# EAGLE schematic GatewaySTM321.0 (EAGLE 5.10)

## Sheet 1 of 3
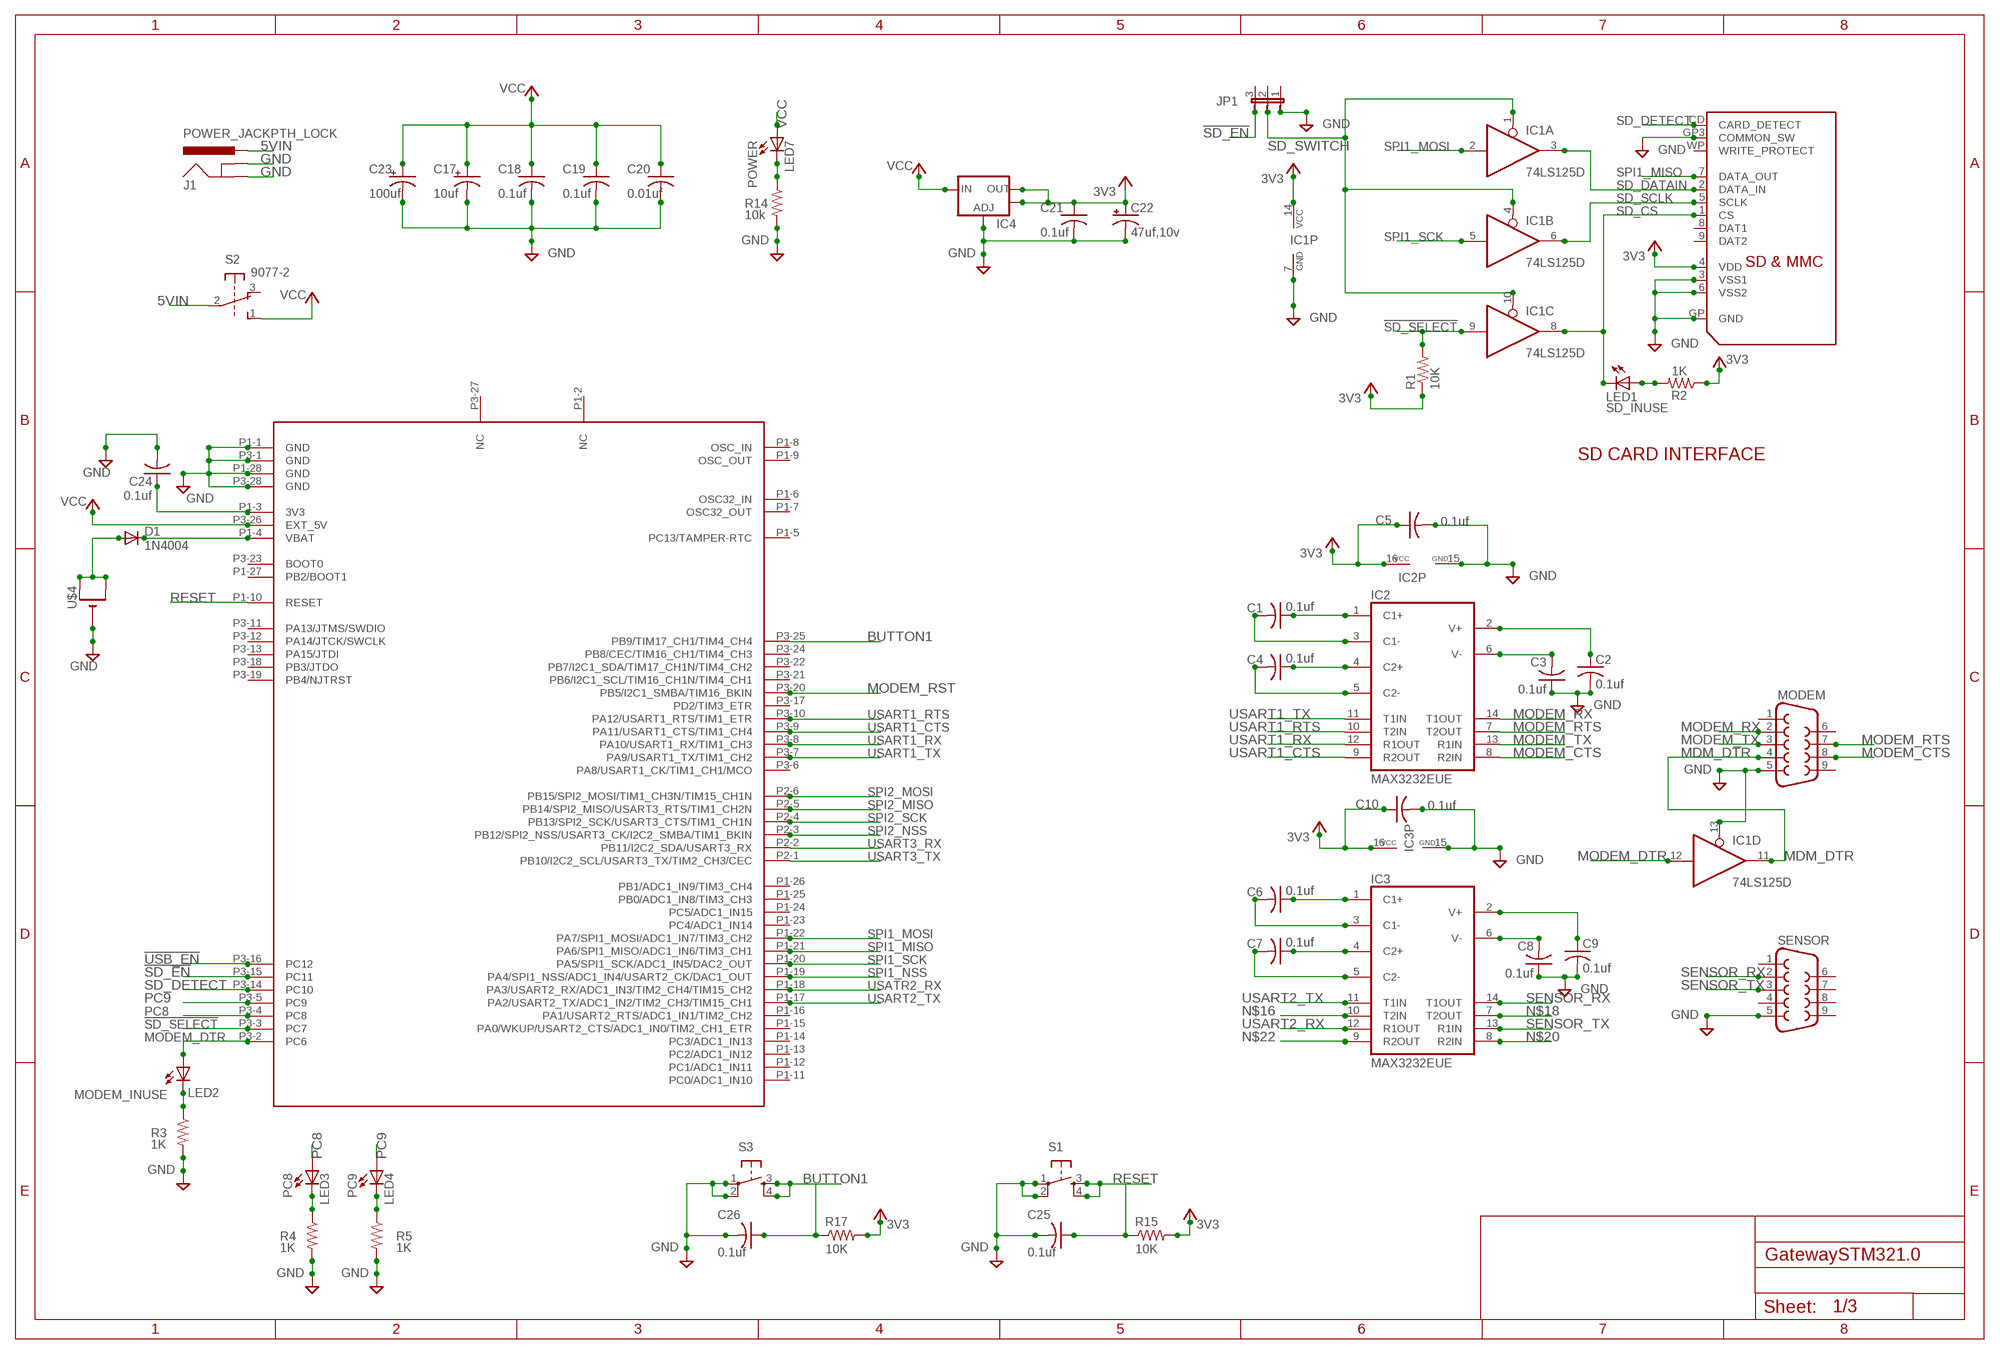
[diagram p0: schematic, sheet 1]

### Parts
C1  0.1uf  C-USC0805K  [C0805K]
C2  0.1uf  C-USC0805K  [C0805K]
C3  0.1uf  C-USC0805K  [C0805K]
C4  0.1uf  C-USC0805K  [C0805K]
C5  0.1uf  C-USC1206  [C1206]
C6  0.1uf  C-USC0805K  [C0805K]
C7  0.1uf  C-USC0805K  [C0805K]
C8  0.1uf  C-USC0805K  [C0805K]
C9  0.1uf  C-USC0805K  [C0805K]
C10  0.1uf  C-USC1206  [C1206]
C17  10uf  CPOL-USSMCC  [SMC_C]
C18  0.1uf  C-USC0805K  [C0805K]
C19  0.1uf  C-USC0805K  [C0805K]
C20  0.01uf  C-USC0805K  [C0805K]
C21  0.1uf  C-USC0805K  [C0805K]
C22  47uf,10v  CPOL-USE2.5-7  [E2,5-7]
C23  100uf  CPOL-USSMCE  [SMC_E]
C24  0.1uf  C-USC0805K  [C0805K]
C25  0.1uf  C-USC0805K  [C0805K]
C26  0.1uf  C-USC0805K  [C0805K]
D1  1N4004  1N4148DO35-7  [DO35-7]
IC1  74LS125D  [SO14]
IC2  MAX3232EUE  [TSSOP16]
IC3  MAX3232EUE  [TSSOP16]
IC4  V_REG_LM1117SOT223  [SOT223]
J1  POWER_JACKPTH_LOCK  [POWER_JACK_PTH_LOCK]
JP1  JP2E  [JP2]
LED1  SD_INUSE  LEDCHIPLED_0805  [CHIPLED_0805]
LED2  MODEM_INUSE  LEDCHIPLED_0805  [CHIPLED_0805]
LED3  PC8  LEDCHIPLED_0805  [CHIPLED_0805]
LED4  PC9  LEDCHIPLED_0805  [CHIPLED_0805]
LED7  POWER  LEDCHIPLED_0805  [CHIPLED_0805]
MODEM  DB9  [DB9]
R1  10K  R-US_R0805  [R0805]
R2  1K  R-US_R0805  [R0805]
R3  1K  R-US_R0805  [R0805]
R4  1K  R-US_R0805  [R0805]
R5  1K  R-US_R0805  [R0805]
R14  10k  R-US_R0805  [R0805]
R15  10K  R-US_R0805  [R0805]
R17  10K  R-US_R0805  [R0805]
S1  TAC_SWITCHPTH  [TACTILE-PTH]
S2  9077-2  [9077-2]
S3  TAC_SWITCHPTH  [TACTILE-PTH]
SENSOR  DB9  [DB9]
U$1  STM32VLDSCVR  [STM32VLDISCVR]
U$2  SDMMC06132  [06132]
U$4  CR1220THM  [CR1220-THM]

### Nets
3V3: C5.1 C10.1 C21.1 C22.+ IC1.14(P:VCC) IC2.16(VCC) IC3.16(VCC) IC4.2(OUT) IC4.4(OUT) R1.1 R2.1 U$2.4(VDD) ; also sheet 2,3
5VIN: J1.PWR S2.2(1:P)
!SD_EN: U$1.P3-15(PC11)
!SD_SELECT: IC1.9(C:I) R1.2 U$1.P3-3(PC7)
!USB_EN: U$1.P3-16(PC12) ; also sheet 2
BUTTON1: C26.1 R17.1 S3.3 S3.4 U$1.P3-25(PB9/TIM17_CH1/TIM4_CH4)
GND: C2.2 C3.1 C5.2 C8.1 C9.2 C10.2 C17.- C18.2 C19.2 C20.2 C21.2 C22.- C23.- C24.2 C25.2 C26.2 IC1.7(P:GND) IC1.13(D:OE) IC2.15(GND) IC3.15(GND) IC4.1(ADJ) J1.GND J1.GNDBREAK MODEM.5 R3.2 R4.2 R5.2 R14.2 S1.1 S1.2 S3.1 S3.2 SENSOR.5 U$1.P1-1(GND) U$1.P1-28(GND) U$1.P3-1(GND) U$1.P3-28(GND) U$2.3(VSS1) U$2.6(VSS2) U$2.GP3(COMMON_SW) U$2.GP(GND) U$4.- ; also sheet 2,3
MDM_DTR: IC1.11(D:O) MODEM.4 ; also sheet 3
MODEM_CTS: IC2.8(R2IN) MODEM.8
MODEM_DTR: IC1.12(D:I) LED2.A U$1.P3-2(PC6)
MODEM_RST: U$1.P3-20(PB5/I2C1_SMBA/TIM16_BKIN) ; also sheet 3
MODEM_RTS: IC2.7(T2OUT) MODEM.7
MODEM_RX: IC2.14(T1OUT) MODEM.2
MODEM_TX: IC2.13(R1IN) MODEM.3
N$1: C6.1 IC3.1(C1+)
N$2: C1.1 IC2.1(C1+)
N$3: C1.2 IC2.3(C1-)
N$4: LED1.A R2.2
N$5: LED2.C R3.1
N$6: C4.1 IC2.4(C2+)
N$7: C4.2 IC2.5(C2-)
N$8: C3.2 IC2.6(V-)
N$9: C2.1 IC2.2(V+)
N$10: C6.2 IC3.3(C1-)
N$11: C7.1 IC3.4(C2+)
N$12: C7.2 IC3.5(C2-)
N$13: C8.2 IC3.6(V-)
N$14: LED3.C R4.1
N$15: C9.1 IC3.2(V+)
N$16: IC3.10(T2IN)
N$17: LED4.C R5.1
N$18: IC3.7(T2OUT)
N$20: IC3.8(R2IN)
N$22: IC3.9(R2OUT)
N$25: LED7.C R14.1
N$32: D1.A U$4.+1(+) U$4.+2(+1)
N$36: C24.1 U$1.P1-3(3V3)
N$40: D1.C U$1.P1-4(VBAT)
PC8: LED3.A U$1.P3-4(PC8)
PC9: LED4.A U$1.P3-5(PC9)
RESET: C25.1 R15.1 S1.3 S1.4 U$1.P1-10(RESET) ; also sheet 3
SD_CS: IC1.8(C:O) LED1.C U$2.1(CS)
SD_DATAIN: IC1.3(A:O) U$2.2(DATA_IN)
SD_DETECT: U$1.P3-14(PC10) U$2.CD(CARD_DETECT)
SD_SCLK: IC1.6(B:O) U$2.5(SCLK)
SD_SWITCH: IC1.1(A:OE) IC1.4(B:OE) IC1.10(C:OE)
SENSOR_RX: IC3.14(T1OUT) SENSOR.2
SENSOR_TX: IC3.13(R1IN) SENSOR.3
SPI1_MISO: U$1.P1-21(PA6/SPI1_MISO/ADC1_IN6/TIM3_CH1) U$2.7(DATA_OUT)
SPI1_MOSI: IC1.2(A:I) U$1.P1-22(PA7/SPI1_MOSI/ADC1_IN7/TIM3_CH2)
SPI1_NSS: U$1.P1-19(PA4/SPI1_NSS/ADC1_IN4/USART2_CK/DAC1_OUT)
SPI1_SCK: IC1.5(B:I) U$1.P1-20(PA5/SPI1_SCK/ADC1_IN5/DAC2_OUT)
SPI2_MISO: U$1.P2-5(PB14/SPI2_MISO/USART3_RTS/TIM1_CH2N) ; also sheet 3
SPI2_MOSI: U$1.P2-6(PB15/SPI2_MOSI/TIM1_CH3N/TIM15_CH1N) ; also sheet 3
SPI2_NSS: U$1.P2-3(PB12/SPI2_NSS/USART3_CK/I2C2_SMBA/TIM1_BKIN) ; also sheet 3
SPI2_SCK: U$1.P2-4(PB13/SPI2_SCK/USART3_CTS/TIM1_CH1N)
USART1_CTS: IC2.9(R2OUT) U$1.P3-9(PA11/USART1_CTS/TIM1_CH4) ; also sheet 3
USART1_RTS: IC2.10(T2IN) U$1.P3-10(PA12/USART1_RTS/TIM1_ETR) ; also sheet 3
USART1_RX: IC2.12(R1OUT) U$1.P3-8(PA10/USART1_RX/TIM1_CH3) ; also sheet 3
USART1_TX: IC2.11(T1IN) U$1.P3-7(PA9/USART1_TX/TIM1_CH2) ; also sheet 3
USART2_RX: IC3.12(R1OUT) ; also sheet 3
USART2_TX: IC3.11(T1IN) U$1.P1-17(PA2/USART2_TX/ADC1_IN2/TIM2_CH3/TIM15_CH1) ; also sheet 3
USART3_RX: U$1.P2-2(PB11/I2C2_SDA/USART3_RX) ; also sheet 2,3
USART3_TX: U$1.P2-1(PB10/I2C2_SCL/USART3_TX/TIM2_CH3/CEC) ; also sheet 2,3
USATR2_RX: U$1.P1-18(PA3/USART2_RX/ADC1_IN3/TIM2_CH4/TIM15_CH2)
V+: R15.2 R17.2 ; supply symbol labelled 3V3
VCC: C17.+ C18.1 C19.1 C20.1 C23.+ IC4.3(IN) LED7.A S2.1(1:S) U$1.P3-26(EXT_5V) ; also sheet 2,3
Unconnected: JP1.1 JP1.2 JP1.3 MODEM.1 MODEM.6 MODEM.9 S2.3(1:O) S2.4(2:S) S2.5(2:P) S2.6(2:O) SENSOR.1 SENSOR.4 SENSOR.6 SENSOR.7 SENSOR.8 SENSOR.9 U$1.P1-2(NC) U$1.P1-5(PC13/TAMPER-RTC) U$1.P1-6(OSC32_IN) U$1.P1-7(OSC32_OUT) U$1.P1-8(OSC_IN) U$1.P1-9(OSC_OUT) U$1.P1-11(PC0/ADC1_IN10) U$1.P1-12(PC1/ADC1_IN11) U$1.P1-13(PC2/ADC1_IN12) U$1.P1-14(PC3/ADC1_IN13) U$1.P1-15(PA0/WKUP/USART2_CTS/ADC1_IN0/TIM2_CH1_ETR) U$1.P1-16(PA1/USART2_RTS/ADC1_IN1/TIM2_CH2) U$1.P1-23(PC4/ADC1_IN14) U$1.P1-24(PC5/ADC1_IN15) U$1.P1-25(PB0/ADC1_IN8/TIM3_CH3) U$1.P1-26(PB1/ADC1_IN9/TIM3_CH4) U$1.P1-27(PB2/BOOT1) U$1.P3-6(PA8/USART1_CK/TIM1_CH1/MCO) U$1.P3-11(PA13/JTMS/SWDIO) U$1.P3-12(PA14/JTCK/SWCLK) U$1.P3-13(PA15/JTDI) U$1.P3-17(PD2/TIM3_ETR) U$1.P3-18(PB3/JTDO) U$1.P3-19(PB4/NJTRST) U$1.P3-21(PB6/I2C1_SCL/TIM16_CH1N/TIM4_CH1) U$1.P3-22(PB7/I2C1_SDA/TIM17_CH1N/TIM4_CH2) U$1.P3-23(BOOT0) U$1.P3-24(PB8/CEC/TIM16_CH1/TIM4_CH3) U$1.P3-27(NC) U$2.8(DAT1) U$2.9(DAT2) U$2.WP(WRITE_PROTECT)

### Notes on the sheet
- SD CARD INTERFACE

## Sheet 2 of 3
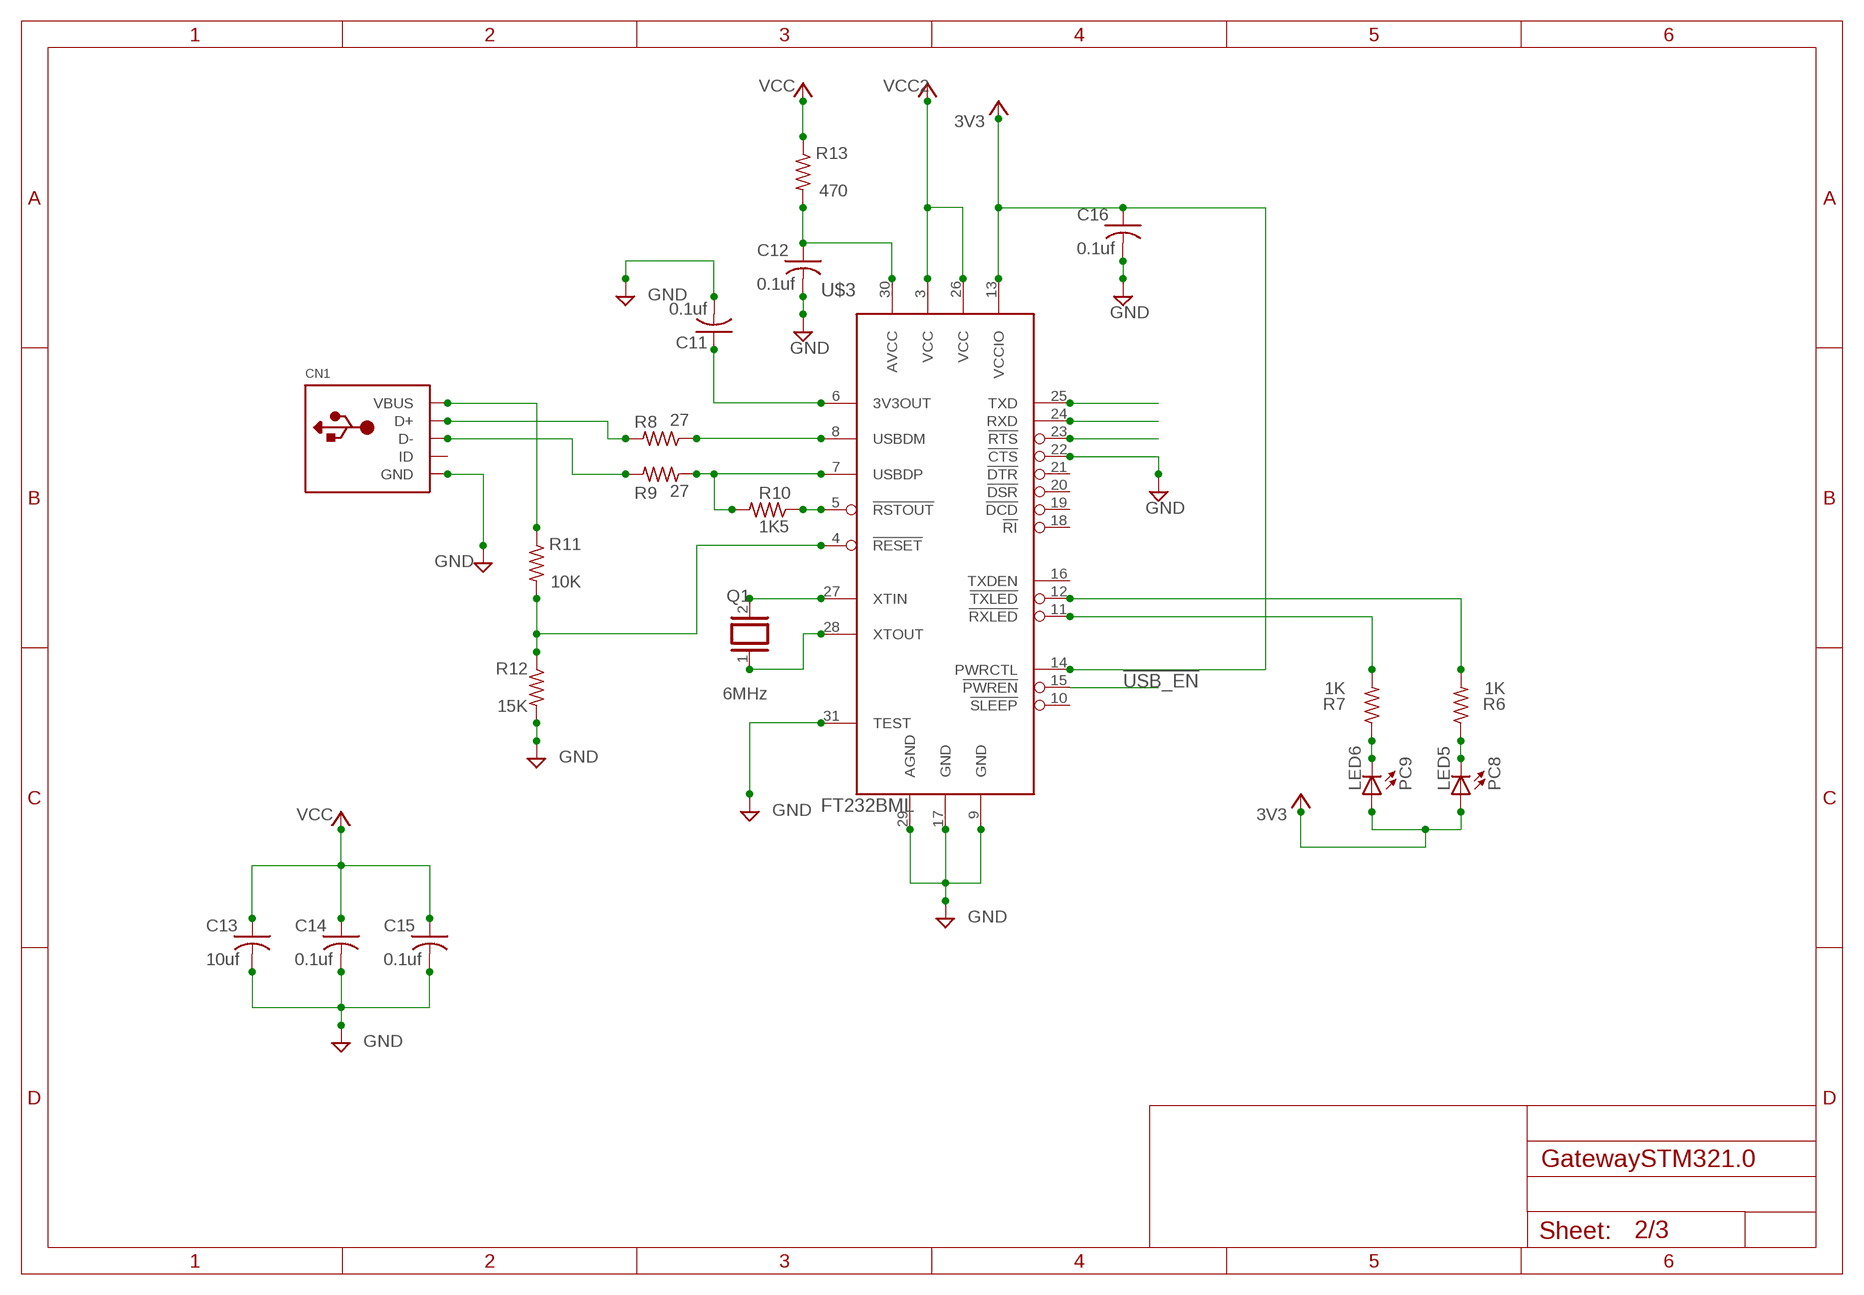
[diagram p1: schematic, sheet 2]

### Parts
C11  0.1uf  C-USC0805K  [C0805K]
C12  0.1uf  C-USC0805K  [C0805K]
C13  10uf  C-USC0805K  [C0805K]
C14  0.1uf  C-USC0805K  [C0805K]
C15  0.1uf  C-USC0805K  [C0805K]
C16  0.1uf  C-USC0805K  [C0805K]
CN1  USBMINIB  [USB-MINIB]
LED5  PC8  LEDCHIPLED_0805  [CHIPLED_0805]
LED6  PC9  LEDCHIPLED_0805  [CHIPLED_0805]
Q1  6MHz  XTAL/S  [QS]
R6  1K  R-US_R0805  [R0805]
R7  1K  R-US_R0805  [R0805]
R8  27  R-US_R0805  [R0805]
R9  27  R-US_R0805  [R0805]
R10  1K5  R-US_R0805  [R0805]
R11  10K  R-US_R0805  [R0805]
R12  15K  R-US_R0805  [R0805]
R13  470  R-US_R0805  [R0805]
U$3  FT232BML  [LQFP32]

### Nets
3V3: C16.1 LED5.A LED6.A U$3.13(VCCIO) U$3.14(PWRCTL) ; also sheet 1,3
!USB_EN: U$3.15(!PWREN) ; also sheet 1
GND: C11.2 C12.2 C13.2 C14.2 C15.2 C16.2 CN1.GND R12.2 U$3.9(GND) U$3.17(GND) U$3.22(!CTS) U$3.29(AGND) U$3.31(TEST) ; also sheet 1,3
N$19: R8.1 U$3.8(USBDM)
N$21: R9.1 R10.2 U$3.7(USBDP)
N$23: Q1.2 U$3.27(XTIN)
N$24: Q1.1 U$3.28(XTOUT)
N$26: R6.2 U$3.12(!TXLED)
N$27: R7.2 U$3.11(!RXLED)
N$28: LED5.C R6.1
N$29: LED6.C R7.1
N$30: CN1.D+ R8.2
N$31: CN1.D- R9.2
N$33: R10.1 U$3.5(!RSTOUT)
N$34: CN1.VBUS R11.1
N$35: C12.1 R13.2 U$3.30(AVCC)
N$37: R11.2 R12.1 U$3.4(!RESET)
N$38: C11.1 U$3.6(3V3OUT)
N$39: U$3.23(!RTS)
USART3_RX: U$3.25(TXD) ; also sheet 1,3
USART3_TX: U$3.24(RXD) ; also sheet 1,3
VCC: C13.1 C14.1 C15.1 R13.1 U$3.3(VCC) U$3.26(VCC) ; supply symbol labelled VCC2 ; also sheet 1,3
Unconnected: CN1.ID U$3.10(!SLEEP) U$3.16(TXDEN) U$3.18(!RI) U$3.19(!DCD) U$3.20(!DSR) U$3.21(!DTR)

## Sheet 3 of 3
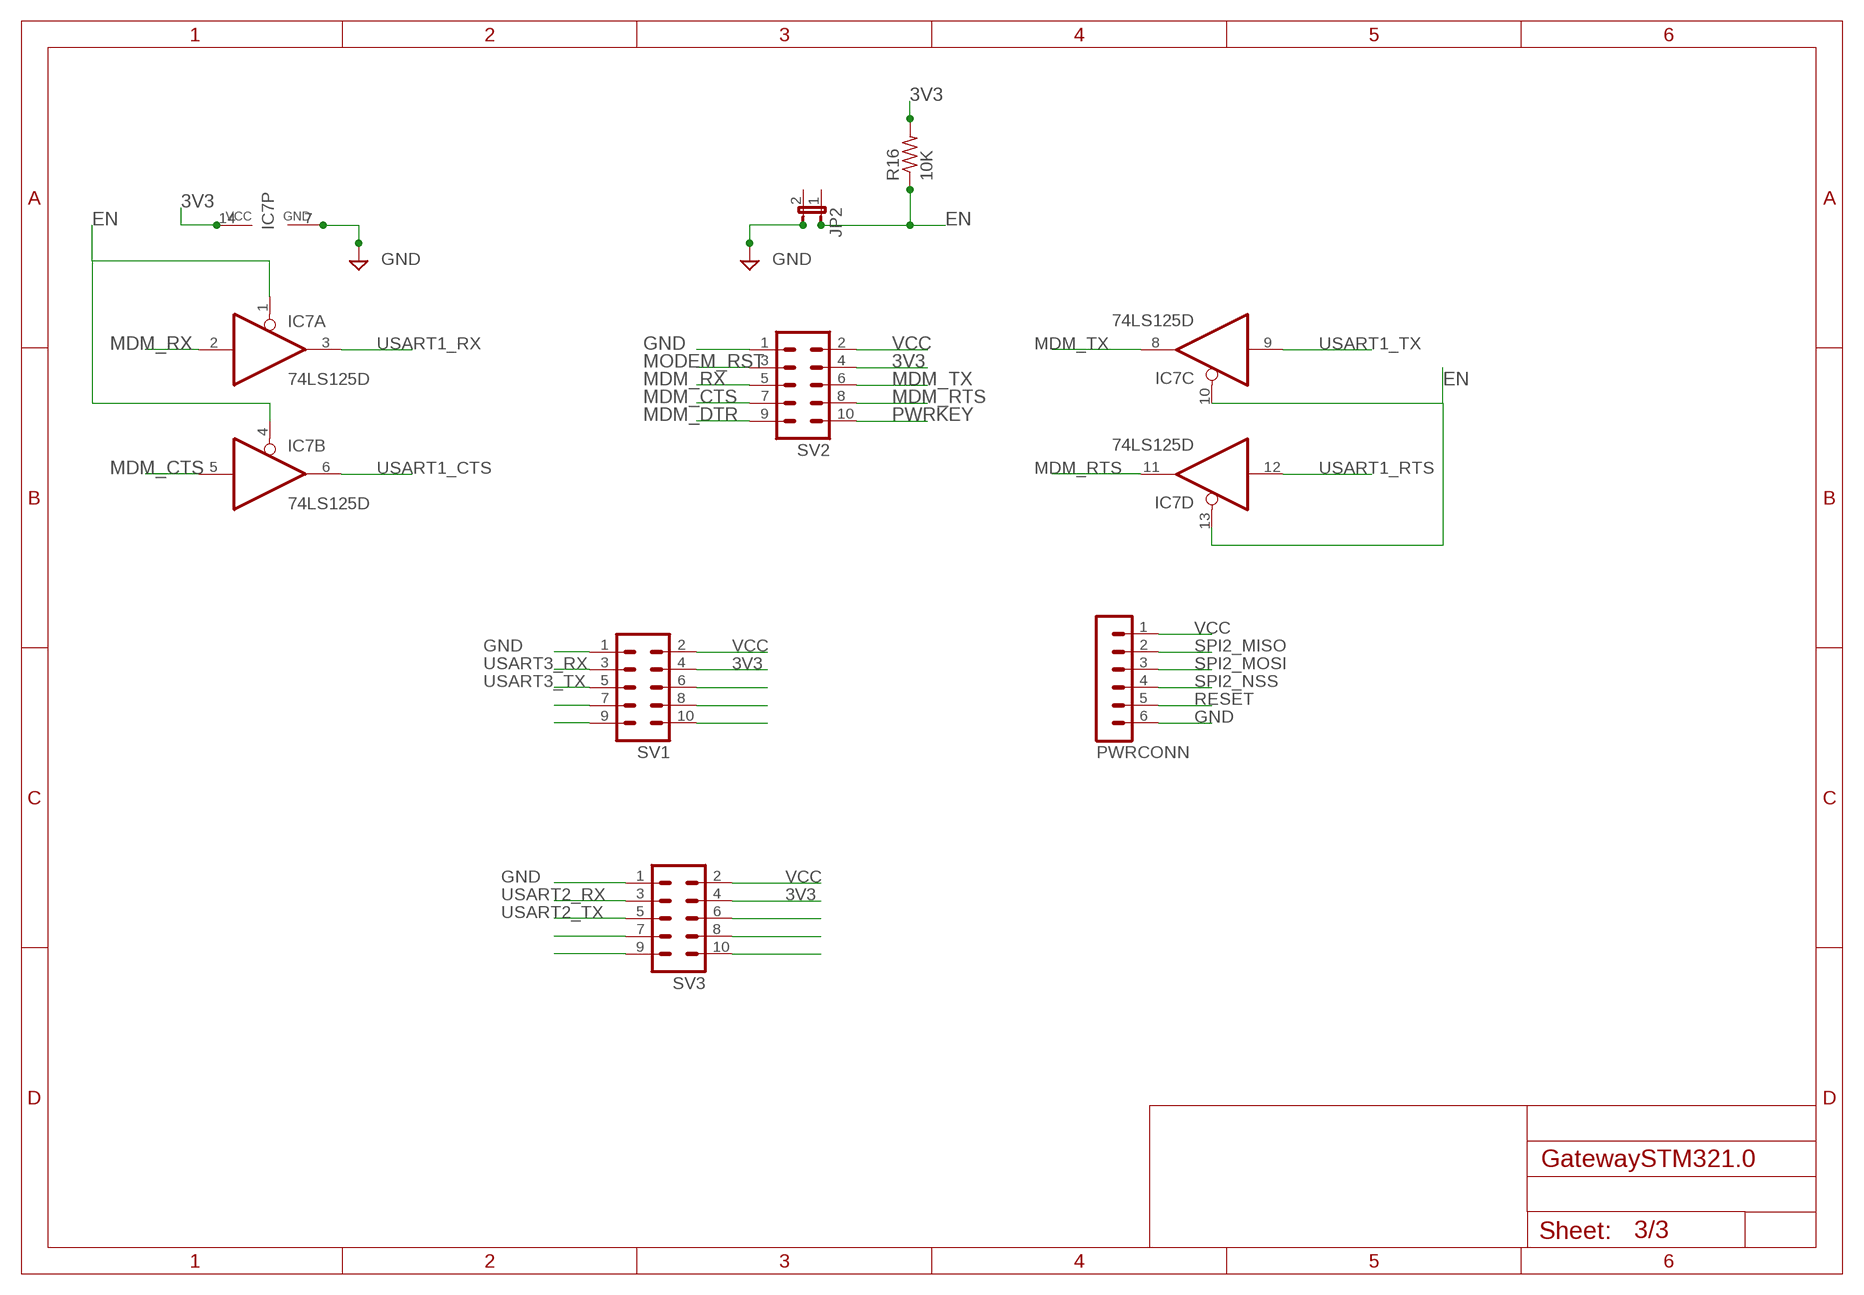
[diagram p2: schematic, sheet 3]

### Parts
IC7  74LS125D  [SO14]
JP2  JP1E  [JP1]
PWRCONN  MA06-1  [MA06-1]
R16  10K  R-US_R0805  [R0805]
SV1  MA05-2  [MA05-2]
SV2  MA05-2  [MA05-2]
SV3  MA05-2  [MA05-2]

### Nets
3V3: IC7.14(P:VCC) R16.2 SV1.4 SV2.4 SV3.4 ; also sheet 1,2
EN: IC7.1(A:OE) IC7.4(B:OE) IC7.10(C:OE) IC7.13(D:OE) R16.1
GND: IC7.7(P:GND) PWRCONN.6 SV1.1 SV2.1 SV3.1 ; also sheet 1,2
MDM_CTS: IC7.5(B:I) SV2.7
MDM_DTR: SV2.9 ; also sheet 1
MDM_RTS: IC7.11(D:O) SV2.8
MDM_RX: IC7.2(A:I) SV2.5
MDM_TX: IC7.8(C:O) SV2.6
MODEM_RST: SV2.3 ; also sheet 1
N$46: SV1.6
N$51: SV1.8
N$52: SV1.7
N$53: SV1.9
N$54: SV1.10
N$58: SV3.7
N$59: SV3.9
N$62: SV3.6
N$63: SV3.8
N$64: SV3.10
PWRKEY: SV2.10
RESET: PWRCONN.5 ; also sheet 1
SPI2_MISO: PWRCONN.2 ; also sheet 1
SPI2_MOSI: PWRCONN.3 ; also sheet 1
SPI2_NSS: PWRCONN.4 ; also sheet 1
USART1_CTS: IC7.6(B:O) ; also sheet 1
USART1_RTS: IC7.12(D:I) ; also sheet 1
USART1_RX: IC7.3(A:O) ; also sheet 1
USART1_TX: IC7.9(C:I) ; also sheet 1
USART2_RX: SV3.3 ; also sheet 1
USART2_TX: SV3.5 ; also sheet 1
USART3_RX: SV1.3 ; also sheet 1,2
USART3_TX: SV1.5 ; also sheet 1,2
VCC: PWRCONN.1 SV1.2 SV2.2 SV3.2 ; also sheet 1,2
Unconnected: JP2.1 JP2.2

## Library data of the parts
C1-C16 C18-C21 C24-C26 = adafruit:C-US: CAPACITOR, American symbol
C17 C22 C23 = rcl:CPOL-US: POLARIZED CAPACITOR, American symbol
CN1 = adafruit:USB: USB Connectors USBMINIB - Surface Mount Female Mini-B USB Connector 4UConnector: 06564 By microbuilder.eu Thru-hole RA Female Mini-B USB Connector 4UConnector: 18732 By ladyada.net
D1 = diode:1N4148: DIODE high speed (Philips)
IC1 IC7 = 74xx-eu:74*125: Quad bus BUFFER, 3-state
IC2 IC3 = maxim:MAX3232*: True RS-232 Transceivers 3.0V to 5.5V, Low-Power up to 1Mbps, Using Four 0.1µF External Capacitors Source: http://pdfserv.maxim-ic.com/en/ds/MAX3222-MAX3241.pdf
IC4 = SparkFun:V_REG_LM1117: Voltage Regulator LM1117 Standard adjustable voltage regulator but in SMD form. Spark Fun Electronics SKU : COM-00595
J1 = SparkFun:POWER_JACK: Power Jack This is the standard 5.5mm barrel jack for power. The PTH is the most common, proven, reliable, footprint. All others are experimental. The Slot footprint only works if the mill layer is transmitted to the PCB fab house so be warned. Spark Fun Electronics SKU : PRT-00119. Mating wall wart : TOL-00298 (and others)
JP1 = jumper:JP2E: JUMPER
JP2 = jumper:JP1E: JUMPER
LED1-LED7 = adafruit:LED: LED OSRAM: - CHIPLED LG R971, LG N971, LY N971, LG Q971, LY Q971, LO R971, LY R971 LH N974, LH R974 LS Q976, LO Q976, LY Q976 LO Q996 - Hyper CHIPLED LW Q18S LB Q993, LB Q99A, LB R99A - SideLED LS A670, LO A670, LY A670, LG A670, LP A670 LB A673, LV A673, LT A673, LW A673 LH A674 LY A675 LS A676, LA A676, LO A676, LY A676, LW A676 LS A679, LY A679, LG A679 - Hyper Micro SIDELED® LS Y876, LA Y876, LO Y876, LY Y876 LT Y87S - SmartLED LW L88C, LW L88S LB L89C, LB L89S, LG L890 LS L89K, LO L89K, LY L89K LS L896, LA L896, LO L896, LY L896 - TOPLED LS T670, LO T670, LY T670, LG T670, LP T670 LSG T670, LSP T670, LSY T670, LOP T670, LYG T670 LG T671, LOG T671, LSG T671 LB T673, LV T673, LT T673, LW T673 LH T674 LS T676, LA T676, LO T676, LY T676, LB T676, LH T676, LSB T676, LW T676 LB T67C, LV T67C, LT T67C, LS T67K, LO T67K, LY T67K, LW E67C LS E67B, LA E67B, LO E67B, LY E67B, LB E67C, LV E67C, LT E67C LW T67C LS T679, LY T679, LG T679 LS T770, LO T770, LY T770, LG T770, LP T770 LB T773, LV T773, LT T773, LW T773 LH T774 LS E675, LA E675, LY E675, LS T675 LS T776, LA T776, LO T776, LY T776, LB T776 LHGB T686 LT T68C, LB T68C - Hyper Mini TOPLED® LB M676 - Mini TOPLED Santana® LG M470 LS M47K, LO M47K, LY M47K Source: http://www.osram.convergy.de/
MODEM SENSOR = SparkFun:DB9: DB9 Connector Standard DB9 (D-Sub 9) serial connector. Can be used for CAN bus as well as RS485 and RS232. Footprint production proven. Spark Fun Electronics SKU : PRT-00429
PWRCONN = con-lstb:MA06-1: PIN HEADER
Q1 = special:XTAL/S: CRYSTAL
R1-R17 = resistor:R-US_: RESISTOR, American symbol
S1 S3 = SparkFun:TAC_SWITCH: Momentary Switch Button commonly used for reset or general input. Spark Fun Electronics SKU : COM-00097
S2 = switch-misc:9077-2: MARQUARDT SWITCH
SV1-SV3 = con-lstb:MA05-2: PIN HEADER
U$1 = stm32vldscvr:STM32VLDSCVR
U$2 = adafruit:SDMMC: SD MMC Card holder 4UCON part #06132 - easy to solder
U$3 = ftdichip:FT232BM: FTDI232BM-LQFP32 package
U$4 = adafruit:CR1220: CR1216/CR1220/CR1225 12mm 3V lithium coin cell Great for battery packup. Both SMT and THM holders. Note the THM package has the ground pads on both sides of the PCB so that the masks are the same - this reduces the cost